# EAGLE design spiderBoardv17-2014-12-18 (EAGLE 6.4)
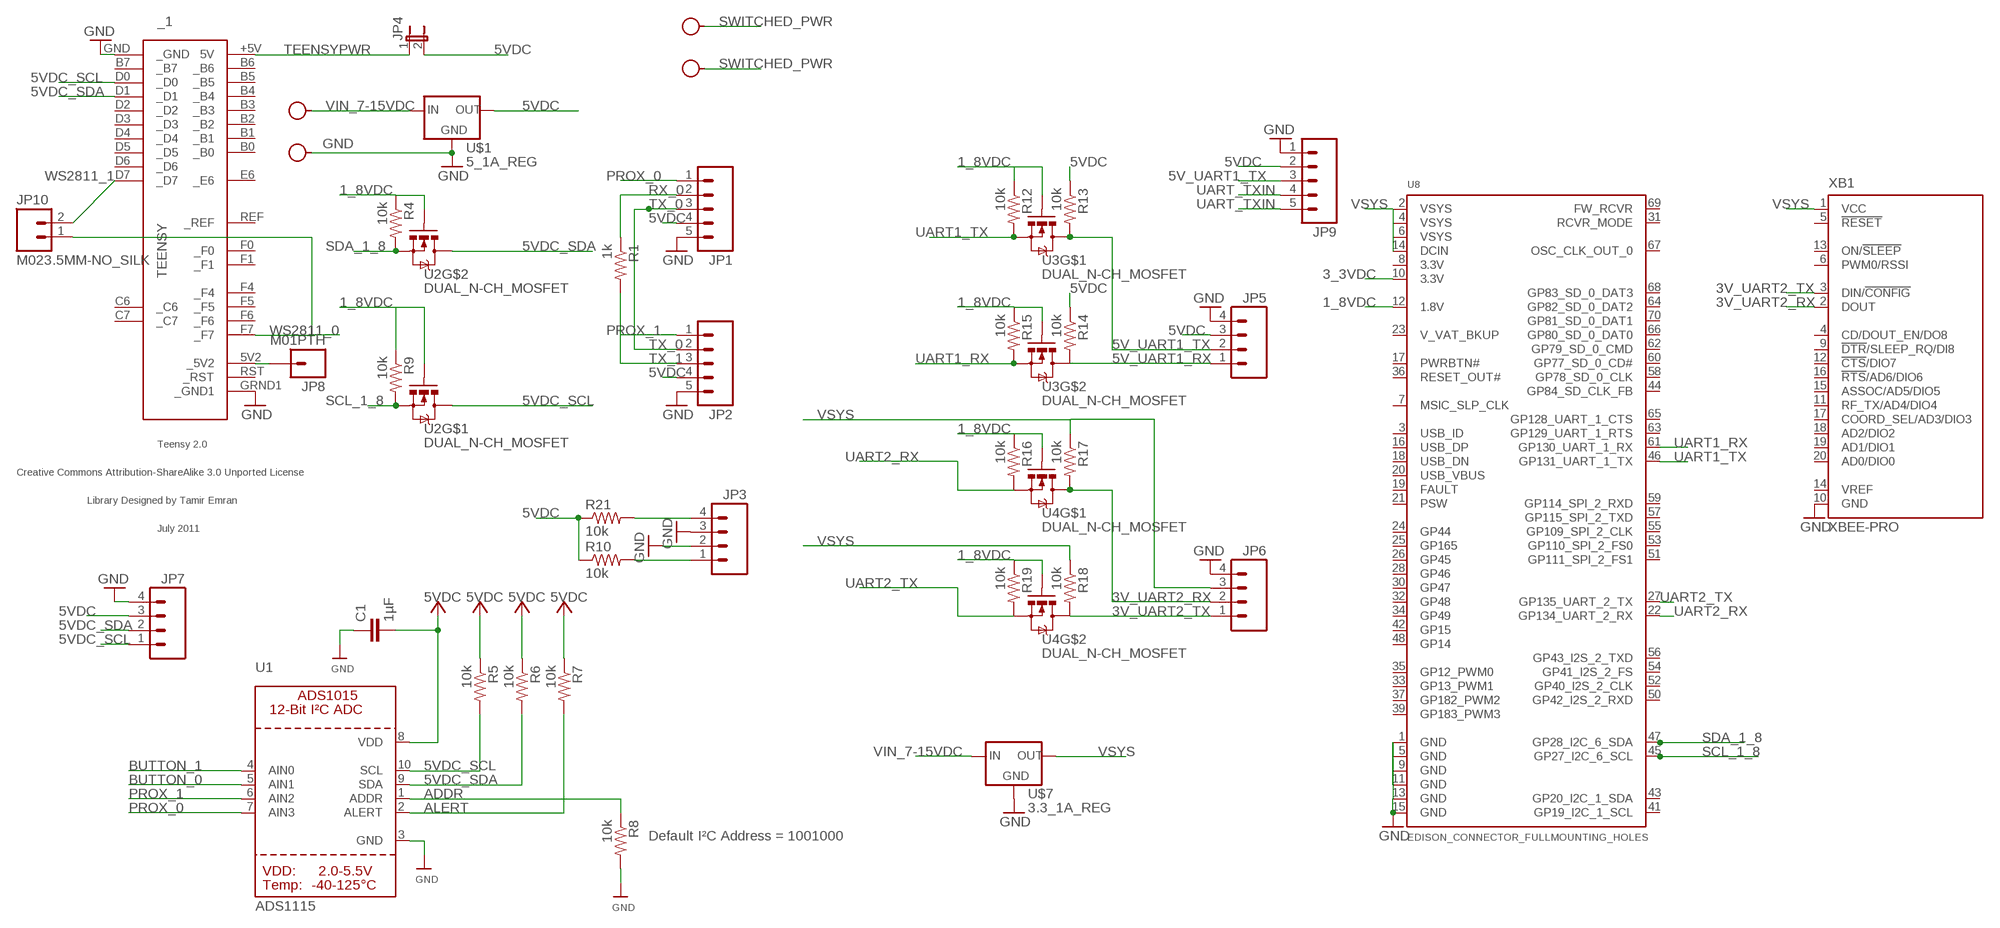
[diagram p0: schematic, sheet 1]

## Parts
_1  TEENSY  [TEENSY]
C1  1µF  CAP0603-CAP  [0603-CAP]
GND  SEW_HOLE-SMALL  [SIMPLE_HOLE_SM]
GND15  SEW_HOLE-SMALL  [SIMPLE_HOLE_SM]
JP1  M05PTH  [1X05]
JP2  M05PTH  [1X05]
JP3  M04PTH  [1X04]
JP4  JUMPER-2SMD-NC  [SJ_2S]
JP5  M04PTH  [1X04]
JP6  M04PTH  [1X04]
JP7  M04PTH  [1X04]
JP8  M01PTH  [1X01]
JP9  M05PTH  [1X05]
JP10  M023.5MM-NO_SILK  [SCREWTERMINAL-3.5MM-2-NS]
R1  1k  RESISTOR0603-RES  [0603-RES]
R4  10k  RESISTOR0603-RES  [0603-RES]
R5  10k  RESISTOR0603-RES  [0603-RES]
R6  10k  RESISTOR0603-RES  [0603-RES]
R7  10k  RESISTOR0603-RES  [0603-RES]
R8  10k  RESISTOR0603-RES  [0603-RES]
R9  10k  RESISTOR0603-RES  [0603-RES]
R10  10k  RESISTOR0603-RES  [0603-RES]
R12  10k  RESISTOR0603-RES  [0603-RES]
R13  10k  RESISTOR0603-RES  [0603-RES]
R14  10k  RESISTOR0603-RES  [0603-RES]
R15  10k  RESISTOR0603-RES  [0603-RES]
R16  10k  RESISTOR0603-RES  [0603-RES]
R17  10k  RESISTOR0603-RES  [0603-RES]
R18  10k  RESISTOR0603-RES  [0603-RES]
R19  10k  RESISTOR0603-RES  [0603-RES]
R21  10k  RESISTOR0603-RES  [0603-RES]
U1  ADS1115  ADC_ADS1015  [MSOP10]
U2  DUAL_N-CH_MOSFET  [SOT363_DUAL_N_MOSFET]
U3  DUAL_N-CH_MOSFET  [SOT363_DUAL_N_MOSFET]
U4  DUAL_N-CH_MOSFET  [SOT363_DUAL_N_MOSFET]
U8  EDISON_CONNECTOR_FULLMOUNTING_HOLES  [EDISON_DAUGHTER]
U$1  5_1A_REG  [1A_REG]
U$7  3.3_1A_REG  [1A_REG]
VIN_7-15VDC  SEW_HOLE-SMALL  [SIMPLE_HOLE_SM]
VIN_7-15VDC1  SEW_HOLE-SMALL  [SIMPLE_HOLE_SM]
XB1  XBEE-PRO  [XBEE-PRO]

## Nets
1_8VDC: R4.1 R9.1 R12.1 R15.1 R16.1 R19.1 U2.2(G) U2.5(G) U3.2(G) U3.5(G) U4.2(G) U4.5(G) U8.12(1.8V)
3_3VDC: U8.10(3.3V)
3V_UART2_RX: JP6.2 R17.2 U4.3(D) XB1.2(DOUT)
3V_UART2_TX: JP6.1 R18.2 U4.6(D) XB1.3(DIN/!CONFIG)
5V_UART1_RX [VSYS]: JP5.1 R14.2 U3.6(D)
5V_UART1_TX: JP5.2 JP9.3 R13.2 U3.3(D)
5VDC [5VDC]: C1.2 JP1.4 JP2.4 JP4.2 JP5.3 JP7.3 JP9.2 R5.1 R6.1 R7.1 R10.1 R13.1 R14.1 R21.1 U1.8(VDD) U$1.OUT ; supply symbol labelled VDD
5VDC_SCL: _1.D0(_D0) JP7.1 R5.2 U1.10(SCL) U2.3(D)
5VDC_SDA: _1.D1(_D1) JP7.2 R6.2 U1.9(SDA) U2.6(D)
ADDR: R8.1 U1.1(ADDR)
ALERT: R7.2 U1.2(ALERT)
BUTTON_0: JP3.4 R21.2 U1.5(AIN1)
BUTTON_1: JP3.1 R10.2 U1.4(AIN0)
GND: _1.GND(_GND) _1.GRND1(_GND1) C1.1 GND.P$1 JP1.5 JP2.5 JP3.2 JP3.3 JP5.4 JP6.4 JP7.4 JP9.1 R8.2 U1.3(GND) U8.1(GND) U8.5(GND) U8.9(GND) U8.11(GND) U8.13(GND) U8.15(GND) U$1.GND U$7.GND XB1.10(GND)
PROX_0: JP1.1 U1.7(AIN3)
PROX_1: JP2.1 U1.6(AIN2)
RX_0: JP1.2 R1.1
SCL_1_8: R9.2 U2.4(S) U8.45(GP27_I2C_6_SCL)
SDA_1_8: R4.2 U2.1(S) U8.47(GP28_I2C_6_SDA)
SWITCHED_PWR [VSYS]: GND15.P$1 VIN_7-15VDC1.P$1
TEENSYPWR: _1.5V2(_5V2) _1.+5V(5V) JP4.1 JP8.1
TX_0: JP1.3 JP2.2
TX_1: JP2.3 R1.2
UART1_RX: R15.2 U3.1(S) U8.61(GP130_UART_1_RX)
UART1_TX: R12.2 U3.4(S) U8.46(GP131_UART_1_TX)
UART2_RX: R16.2 U4.4(S) U8.22(GP134_UART_2_RX)
UART2_TX: R19.2 U4.1(S) U8.27(GP135_UART_2_TX)
UART_TXIN: JP9.4 JP9.5
VIN_7-15VDC [VSYS]: U$1.IN U$7.IN VIN_7-15VDC.P$1
VSYS: JP6.3 R17.1 R18.1 U8.2(VSYS) U8.4(VSYS) U8.6(VSYS) U8.14(DCIN) U$7.OUT XB1.1(VCC)
WS2811_0: _1.F7(_F7) JP10.1
WS2811_1: _1.D7(_D7) JP10.2
Unconnected: _1.B0(_B0) _1.B1(_B1) _1.B2(_B2) _1.B3(_B3) _1.B4(_B4) _1.B5(_B5) _1.B6(_B6) _1.B7(_B7) _1.C6(_C6) _1.C7(_C7) _1.D2(_D2) _1.D3(_D3) _1.D4(_D4) _1.D5(_D5) _1.D6(_D6) _1.E6(_E6) _1.F0(_F0) _1.F1(_F1) _1.F4(_F4) _1.F5(_F5) _1.F6(_F6) _1.REF(_REF) _1.RST(_RST) U8.3(USB_ID) U8.7(MSIC_SLP_CLK) U8.8(3.3V) U8.16(USB_DP) U8.17(PWRBTN#) U8.18(USB_DN) U8.19(FAULT) U8.20(USB_VBUS) U8.21(PSW) U8.23(V_VAT_BKUP) U8.24(GP44) U8.25(GP165) U8.26(GP45) U8.28(GP46) U8.30(GP47) U8.31(RCVR_MODE) U8.32(GP48) U8.33(GP13_PWM1) U8.34(GP49) U8.35(GP12_PWM0) U8.36(RESET_OUT#) U8.37(GP182_PWM2) U8.39(GP183_PWM3) U8.41(GP19_I2C_1_SCL) U8.42(GP15) U8.43(GP20_I2C_1_SDA) U8.44(GP84_SD_CLK_FB) U8.48(GP14) U8.50(GP42_I2S_2_RXD) U8.51(GP111_SPI_2_FS1) U8.52(GP40_I2S_2_CLK) U8.53(GP110_SPI_2_FS0) U8.54(GP41_I2S_2_FS) U8.55(GP109_SPI_2_CLK) U8.56(GP43_I2S_2_TXD) U8.57(GP115_SPI_2_TXD) U8.58(GP78_SD_0_CLK) U8.59(GP114_SPI_2_RXD) U8.60(GP77_SD_0_CD#) U8.62(GP79_SD_0_CMD) U8.63(GP129_UART_1_RTS) U8.64(GP82_SD_0_DAT2) U8.65(GP128_UART_1_CTS) U8.66(GP80_SD_0_DAT0) U8.67(OSC_CLK_OUT_0) U8.68(GP83_SD_0_DAT3) U8.69(FW_RCVR) U8.70(GP81_SD_0_DAT1) XB1.4(CD/DOUT_EN/DO8) XB1.5(!RESET) XB1.6(PWM0/RSSI) XB1.9(!DTR!/SLEEP_RQ/DI8) XB1.11(RF_TX/AD4/DIO4) XB1.12(!CTS!/DIO7) XB1.13(ON/!SLEEP) XB1.14(VREF) XB1.15(ASSOC/AD5/DIO5) XB1.16(!RTS!/AD6/DIO6) XB1.17(COORD_SEL/AD3/DIO3) XB1.18(AD2/DIO2) XB1.19(AD1/DIO1) XB1.20(AD0/DIO0)

## Notes on the sheet
- Default I²C Address = 1001000

## Library data of the parts
_1 = teensy:TEENSY: Teensy 2.0 Original Design by Clint Fisher Modified Design by Tamir Emran Licensed Under Creative Commons Attribution-ShareAlike 3.0 Unported (CC BY-SA 3.0)
C1 = SparkFun-Capacitors:CAP: Capacitor Standard 0603 ceramic capacitor, and 0.1" leaded capacitor.
GND GND15 VIN_7-15VDC VIN_7-15VDC1 = LilyPad-Wearables:SEW_HOLE-SMALL: .070" hole with 20mil annular ring
JP1 JP2 JP9 = SparkFun-Connectors:M05: Header 5 Standard 5-pin 0.1" header. Use with straight break away headers (SKU : PRT-00116), right angle break away headers (PRT-00553), swiss pins (PRT-00743), machine pins (PRT-00117), and female headers (PRT-00115). Molex polarized connector foot print use with SKU : PRT-08230 with associated crimp pins and housings.
JP3 JP5-JP7 = SparkFun-Connectors:M04: Header 4 Standard 4-pin 0.1" header. Use with straight break away headers (SKU : PRT-00116), right angle break away headers (PRT-00553), swiss pins (PRT-00743), machine pins (PRT-00117), and female headers (PRT-00115). Molex polarized connector foot print use with SKU : PRT-08231 with associated crimp pins and housings. 1MM SMD Version SKU: PRT-10208
JP4 = SparkFun-Passives:JUMPER-2: Jumper Basic 0.1" spaced jumper. Use with breakaway headers.
JP8 = SparkFun-Connectors:M01: Header 1 Standard 1-pin 0.1" header. Use with straight break away headers (SKU : PRT-00116), right angle break away headers (PRT-00553), swiss pins (PRT-00743), machine pins (PRT-00117), and female headers (PRT-00115).
JP10 = SparkFun-Connectors:M02: Standard 2-pin 0.1" header. Use with - straight break away headers ( PRT-00116) - right angle break away headers (PRT-00553) - swiss pins (PRT-00743) - machine pins (PRT-00117) - female headers (PRT-00115) Molex polarized connector foot print use with: PRT-08233 with associated crimp pins and housings. 2.54_SCREWTERM for use with PRT-10571. 3.5mm Screw Terminal footprints for PRT-08084 5mm Screw Terminal footprints for use with PRT-08433
R1 R4-R10 R12-R19 R21 = SparkFun-Passives:RESISTOR: Resistor Basic schematic elements and footprints for 0603, 1206, and PTH resistors.
U1 = microbuilder:ADC_ADS1015: ADS1015 - 12-bit 4-Channel I2C ADC with Internal PGA VDD: 2.0-5.5V Sampling Rate: 3.3ksps Gain Settings: 2/3, 1, 2, 4, 8, 16 I2C Address: ADDR low = 1001000x, ADDR high = 1001001x Internal Comparator The ADS1015 includes an internal comparator that can be set to output a high-level on ALERT when the conversion results exceeeds a pre-defined upper level, and will deassert itself when the level falls below a pre-defined lower threshold level. It can also be set to windowed mode where the ALERT pin will be asserted if the data exceeds the upper threshold or falls below the lower threshold.
U2-U4 = bss138_part:DUAL_N-CH_MOSFET
U8 = Edison:EDISON_CONNECTOR_FULL
U$1 = pololu:5_1A_REG
U$7 = pololu:3.3_1A_REG
XB1 = mpinnermaxstream:XBEE: XBee (TM) /XBee-PRO(TM) OEM RF Modules Source: MaxStream, Inc. xbee_productmanual.pdf; MPN: XBP24-AWI-001; OC_FARNELL: 1337916; OC_NEWARK: 42M2667

## Net classes
0 default: width 0.152 mm
1 5VDC: width 0.406 mm
2 VSYS: width 0.762 mm

## Board
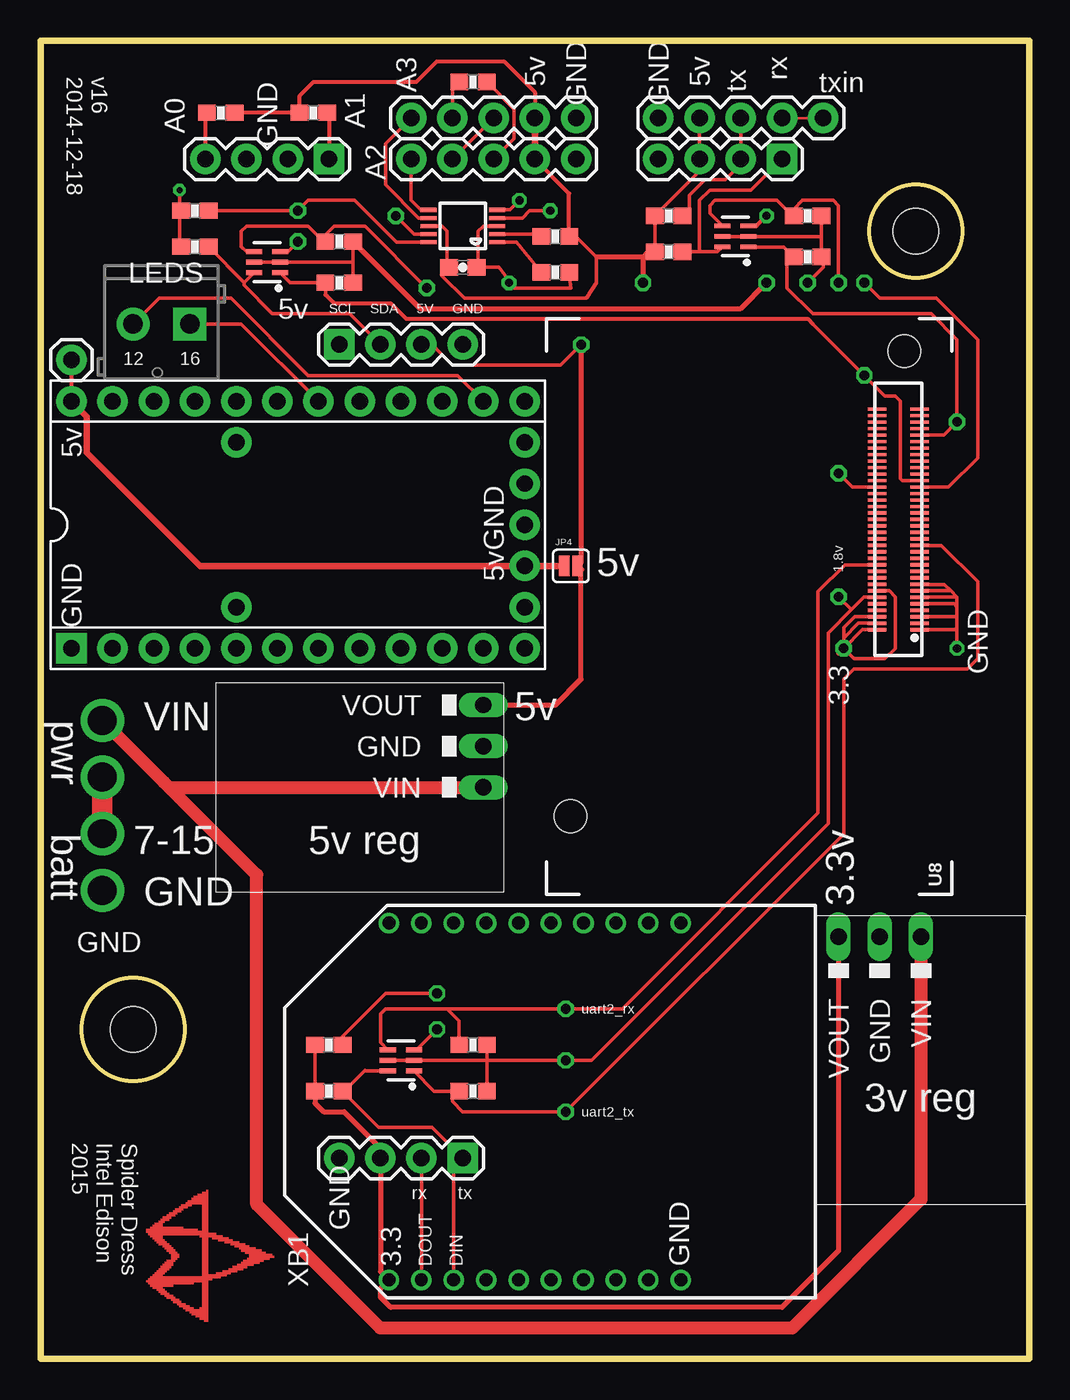
[diagram p1: board, top side]
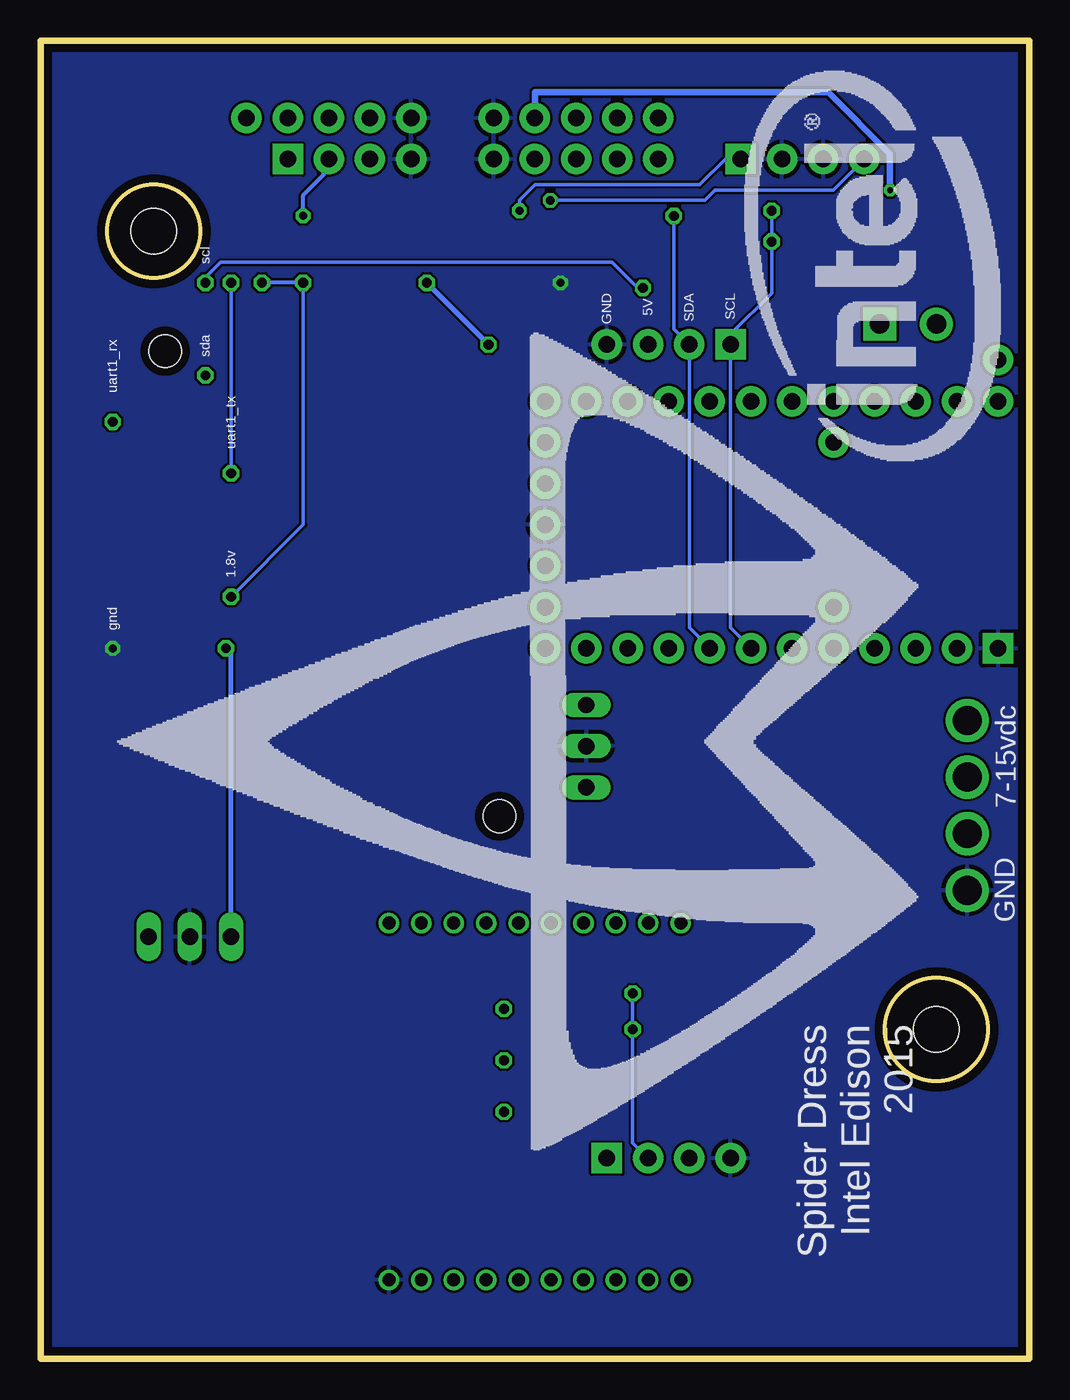
[diagram p2: board, bottom side, seen from below]

Size 60.96 x 81.29 mm. Coordinates in mm from the lower left corner, seen from the top.
Outline: 0,0 60.95,0 60.95,81.29 0,81.27
Outline: 0,0 60.96,0 60.96,81.28 0,81.28 0,81.27
Outline: 0,81.27 0,0
Outline: circle at 5.71,20.32 radius 3.17
Outline: circle at 53.98,69.53 radius 2.86
Copper layers (1*16): Top 0.0178mm / dielectric 59mil / Bottom 0.0178mm
Design rules "SSC-EAGLE-2Lyr_v1.0.0.3": minimum track width 6mil, minimum drill 14mil, track to track 6mil, track to pad 6mil, pad to pad 6mil, via to via 6mil, smd to smd 6mil, copper to edge 20mil, drill to drill 16mil, minimum pad ring 8mil, minimum via ring 8mil, stop-mask expansion 3mil, vias tented up to drill 0mil, thermal gap 10mil
Holes 2.8 mm at 5.71,20.32 53.98,69.53

### Footprints (pad centres in the part's own frame; a part is rotated, then mirrored left to right if it is on the bottom)
TEENSY = drill 1.016 pad 1.88: 5V2 13.97,-2.54; +5V -13.97,7.62; B0 -11.43,-7.62; B1 -8.89,-7.62; B2 -6.35,-7.62; B3 -3.81,-7.62; B4 8.89,7.62; B5 6.35,7.62; B6 3.81,7.62; B7 -1.27,-7.62; C6 11.43,-7.62; C7 13.97,-7.62; D0 1.27,-7.62; D1 3.81,-7.62; D2 6.35,-7.62; D3 8.89,-7.62; D4 13.97,5.08; D5 13.97,-5.08; D6 13.97,7.62; D7 11.43,7.62; E6 -3.81,-5.08; F0 -11.43,7.62; F1 -8.89,7.62; F4 -6.35,7.62; F5 -3.81,7.62; F6 -1.27,7.62; F7 1.27,7.62; GRND1 13.97,0; REF -3.81,5.08; RST 13.97,2.54 | drill 1.016 pad 1.88 square: GND -13.97,-7.62
0603-CAP = smd 1.1 x 1: 1 -0.85,0; 2 0.85,0
SIMPLE_HOLE_SM = drill 1.778 pad 2.286: P$1 0,0
1X05 = drill 1.016 pad 1.88: 1 0,0; 2 2.54,0; 3 5.08,0; 4 7.62,0; 5 10.16,0
1X04 = drill 1.016 pad 1.88 square: 1 0,0 | drill 1.016 pad 1.88: 2 2.54,0; 3 5.08,0; 4 7.62,0
SJ_2S = smd 0.635 x 1.27: 1 -0.412,0; 2 0.412,0
1X01 = drill 1.016 pad 1.88: 1 0,0
SCREWTERMINAL-3.5MM-2-NS = drill 1.2 pad 2.032 square: 1 0,0 | drill 1.2 pad 2.032: 2 3.5,0
0603-RES = smd 1.1 x 1: 1 -0.85,0; 2 0.85,0
MSOP10 = smd 0.25 x 1: 1 -1,-2.113; 2 -0.5,-2.113; 3 0,-2.113; 4 0.5,-2.113; 5 1,-2.113; 6 1,2.113; 7 0.5,2.113; 8 0,2.113; 9 -0.5,2.113; 10 -1,2.113
SOT363_DUAL_N_MOSFET = smd 0.3 x 0.99: 1 -0.65,-0.8; 2 0,-0.8; 3 0.65,-0.8; 4 0.65,0.81; 5 0,0.81; 6 -0.65,0.81
EDISON_DAUGHTER = smd 1.14 x 0.2: 1 1.98,19.17; 2 4.62,19.17; 3 1.98,18.77; 4 4.62,18.77; 5 1.98,18.37; 6 4.62,18.37; 7 1.98,17.97; 8 4.62,17.97; 9 1.98,17.57; 10 4.62,17.57; 11 1.98,17.17; 12 4.62,17.17; 13 1.98,16.77; 14 4.62,16.77; 15 1.98,16.37; 16 4.62,16.37; 17 1.98,15.97; 18 4.62,15.97; 19 1.98,15.57; 20 4.62,15.57; 21 1.98,15.17; 22 4.62,15.17; 23 1.98,14.77; 24 4.62,14.77; 25 1.98,14.37; 26 4.62,14.37; 27 1.98,13.97; 28 4.62,13.97; 29 1.98,13.57; 30 4.62,13.57; 31 1.98,13.17; 32 4.62,13.17; 33 1.98,12.77; 34 4.62,12.77; 35 1.98,12.37; 36 4.62,12.37; 37 1.98,11.97; 38 4.62,11.97; 39 1.98,11.57; 40 4.62,11.57; 41 1.98,11.17; 42 4.62,11.17; 43 1.98,10.77; 44 4.62,10.77; 45 1.98,10.37; 46 4.62,10.37; 47 1.98,9.97; 48 4.62,9.97; 49 1.98,9.57; 50 4.62,9.57; 51 1.98,9.17; 52 4.62,9.17; 53 1.98,8.77; 54 4.62,8.77; 55 1.98,8.37; 56 4.62,8.37; 57 1.98,7.97; 58 4.62,7.97; 59 1.98,7.57; 60 4.62,7.57; 61 1.98,7.17; 62 4.62,7.17; 63 1.98,6.77; 64 4.62,6.77; 65 1.98,6.37; 66 4.62,6.37; 67 1.98,5.97; 68 4.62,5.97; 69 1.98,5.57; 70 4.62,5.57 | hole 2: 23.53,30.67; 2.93,1.98
1A_REG = drill 1.016 long: GND 8.89,1.27; IN 6.35,1.27; OUT 11.43,1.27
XBEE-PRO = drill 0.8 pad 1.27: 1 -11,9; 2 -11,7; 3 -11,5; 4 -11,3; 5 -11,1; 6 -11,-1; 7 -11,-3; 8 -11,-5; 9 -11,-7; 10 -11,-9; 11 11,-9; 12 11,-7; 13 11,-5; 14 11,-3; 15 11,-1; 16 11,1; 17 11,3; 18 11,5; 19 11,7; 20 11,9

### Placement (x,y rotation side)
_1  15.88,51.44 0 top
C1  26.04,67.31 180 top
GND  3.81,28.89 0 top
GND15  3.81,35.88 0 top
JP1  22.86,76.52 0 top
JP2  22.86,73.98 0 top
JP3  17.78,73.98 180 top
JP4  32.7,48.9 0 top
JP5  45.72,73.98 180 top
JP6  26.04,12.38 180 top
JP7  18.41,62.55 0 top
JP8  1.91,61.59 0 top
JP9  38.1,76.52 0 top
JP10  9.21,63.82 180 top
R1  26.67,78.74 0 top
R4  18.41,66.36 180 top
R5  9.53,70.8 0 top
R6  9.53,68.58 0 top
R7  31.75,69.22 180 top
R8  31.75,66.99 0 top
R9  18.41,68.9 180 top
R10  16.83,76.83 0 top
R12  47.31,70.48 180 top
R13  38.73,70.48 0 top
R14  38.73,68.26 0 top
R15  47.31,67.94 180 top
R16  26.67,19.37 180 top
R17  17.78,19.37 0 top
R18  17.78,16.51 0 top
R19  26.67,16.51 180 top
R21  11.11,76.83 180 top
U1  26.04,69.85 90 top
U2  13.97,67.63 90 top
U3  42.86,69.22 90 top
U4  22.23,18.41 90 top
U8  56.2,64.14 180 top
U$1  28.57,28.89 90 top
U$7  60.64,27.3 180 top
U$9  [NOUK-800]  20.32,38.1 180 bottom
U$11  [NOUKLOGO300MIL_COPPER]  8.57,6.38 270 top
U$12  [INTEL_1IN]  7.11,66.17 90 bottom
VIN_7-15VDC  3.81,39.37 0 top
VIN_7-15VDC1  3.81,32.38 0 top
XB1  30.48,15.88 90 top

### Tracks (layer width: path | path; a pad name or v marks a point on that pad's centre or on a via)
1_8VDC  (via drill 0.6)
  Top 0.203: R12.1 48.16,69.22 | 48.16,69.22 R15.1 48.26,67.94 48.26,67.31 v47.31,66.36 | 48.16,69.22 U3.2 U3.5 | U2.5 U2.2 19.27,67.63 | R9.1 19.27,67.63 | 19.27,67.63 R4.1 | U4.5 U4.2 27.62,18.41 | R16.1 27.52,18.52 27.62,18.41 | R19.1 27.52,18.31 27.62,18.41 | U8.12 50.77,46.97 50.01,46.2 | 50.01,46.2 48.58,44.77 48.58,33.02 33.97,18.41 v32.38,18.41 27.62,18.41 | v49.21,46.99 50.01,46.2
  Top 0.305: R9.1 23.39,64.77 43.18,64.77 v44.77,66.36
  Bottom 0.203: v49.21,46.99 44.77,51.44 v44.77,66.36
  Bottom 0.254: v44.77,66.36 v47.31,66.36
3V_UART2_RX  (via drill 0.6)
  Top 0.203: XB1.2 23.5,4.89 JP6.2 | U4.3 23.19,19.07 v24.45,20.32 | R17.2 18.63,19.9 21.27,22.54 v24.45,22.54
  Bottom 0.203: JP6.2 24.45,13.34 v24.45,20.32 v24.45,22.54
3V_UART2_TX
  Top 0.203: XB1.3 25.48,11.83 JP6.1 24.13,14.29 20.85,14.29 R18.2 18.73,16.51 20,17.78 20.02,17.77 U4.6
5V_UART1_RX
  Top 0.203: R14.2 40.64,68.26 | 40.64,68.26 41.75,68.26 U3.6 | JP5.1 43.81,72.07 41.27,72.07 40.64,71.44 40.64,68.26
5V_UART1_TX  (via drill 0.5)
  Top 0.203: R13.2 40.01,70.48 40.01,71.75 40.96,72.71 42.23,72.71 43.18,73.66 JP5.2 JP9.3
  Top 0.254: U3.3 44.15,69.86 v44.77,70.48
  Bottom 0.254: v44.77,70.48 44.77,71.75 43.5,73.03 43.5,73.66 JP5.2
5VDC  (via drill 0.36, 0.6)
  Top 0.203: R14.1 R13.1 40.64,73.24 JP9.2 JP5.3 | U1.8 24.77,69.85 25.08,69.53 25.08,67.41 C1.2 24.77,66.99 24.77,66.78 26.14,65.41 33.66,65.41 34.29,66.36 34.29,67.94 33.02,69.22 R7.1 | R5.1 8.57,70.91 | 8.57,70.91 v8.57,72.07 | R6.1 8.57,68.68 8.57,70.91 | JP7.3 24.13,62.55 25.4,61.28 32.07,61.28 v33.34,62.55
  Top 0.254: R7.1 32.6,71.86 JP2.4 | JP1.4 30.48,78.11 28.57,80.01 24.45,80.01 23.18,78.74 16.83,78.74 15.98,77.89 R10.1 R21.1
  Top 0.305: 37.15,67.94 v37.15,66.36 | 37.15,67.94 37.47,68.26 R14.1 | v33.34,62.55 33.34,49.12 JP4.2 | 37.15,67.94 34.29,67.94 | U$1.OUT 31.75,40.32 33.34,41.91 33.34,48.67
  Top 0.406: JP2.4 JP1.4 | 33.34,48.67 JP4.2
  Bottom 0.305: v37.15,66.36 v33.34,62.55
  Bottom 0.406: v8.57,72.07 8.57,74.3 12.38,78.11 30.48,78.11 JP1.4
5VDC_SCL  (via drill 0.6)
  Top 0.203: U2.3 15.26,68.28 v15.88,68.9 | R5.2 v15.88,70.8 16.51,71.44 19.37,71.44 21.95,68.85 U1.10
  Bottom 0.203: v15.88,70.8 v15.88,68.9 15.88,65.72 18.41,63.18 JP7.1 18.41,45.09 _1.D0
5VDC_SDA  (via drill 0.6)
  Top 0.203: R6.2 12.54,66.36 | 12.54,66.36 U2.6 12.7,66.52 | JP7.2 19.05,64.45 14.29,64.45 12.54,66.2 12.54,66.36 | U1.9 23.04,69.35 v21.91,70.48
  Bottom 0.203: v21.91,70.48 21.91,63.5 JP7.2 20.95,45.09 _1.D1
ADDR
  Top 0.203: U1.1 29.36,68.85 R8.1
ALERT
  Top 0.203: R7.2 30.58,69.53 30.48,69.53 30.3,69.35 U1.2
BUTTON_0  (via drill 0.5)
  Top 0.203: U1.5 28.94,70.85 v29.53,71.44
  Top 0.254: R21.2 10.16,76.73 JP3.4
  Bottom 0.203: v29.53,71.44 20,71.44 19.37,72.07 12.06,72.07 JP3.4
BUTTON_1  (via drill 0.5)
  Top 0.203: v31.43,70.8 30.16,70.8 29.71,70.35 U1.4
  Top 0.254: R10.2 17.78,76.73 JP3.1
  Bottom 0.203: JP3.1 18.73,73.98 20.32,72.39 30.48,72.39 31.43,71.44 v31.43,70.8
GND  (via drill 0.5)
  Top 0.152: v28.89,66.36 28.94,66.4
  Top 0.203: U8.15 55.74,47.77 56.14,47.37 | 56.52,46.99 56.52,46.35 | 56.52,46.35 56.52,45.72 | 56.52,45.72 56.52,45.09 | 56.52,45.09 v56.52,43.81 | U8.1 56.4,44.97 56.52,45.09 | U8.5 56.47,45.77 56.52,45.72 | U8.9 56.3,46.56 56.52,46.35 | U8.11 56.49,46.97 56.52,46.99 | U8.13 56.14,47.37 | 56.14,47.37 56.52,46.99 | R8.2 32.6,66.89 32.7,66.04 29.21,66.04 28.94,66.4 28.26,67.31 C1.1 26.99,67.41 26.99,69.53 27.3,69.85 U1.3
  pour Bottom: -0.32,-0.32 60.96,0 60.96,81.6 -0.32,81.6
PROX_0
  Top 0.203: U1.7 23.31,70.35 21.27,72.39 21.27,74.93 JP1.1
PROX_1
  Top 0.203: U1.6 23.45,70.85 22.86,71.44 JP2.1
RX_0
  Top 0.203: JP1.2 25.4,78.32 R1.1
SCL_1_8  (via drill 0.6)
  Top 0.203: U2.4 13.14,68.26 12.7,68.26 12.38,68.58 12.38,69.53 12.7,69.85 16.51,69.85 17.46,68.9 R9.2 17.57,69.32 18.1,69.85 20,69.85 v23.81,66.04 | U8.45 55.99,53.77 57.78,55.56 57.78,62.87 55.24,65.41 51.75,65.41 v50.8,66.36
  Bottom 0.203: v50.8,66.36 50.8,66.67 49.85,67.63 25.72,67.63 24.13,66.04 v23.81,66.04
SDA_1_8  (via drill 0.6)
  Top 0.203: U2.1 15.39,66.36 R4.2 17.57,65.62 | U8.47 53.15,54.16 53.02,54.29 53.02,59.05 52.7,59.37 52.07,59.37 v50.8,60.64 47.62,63.82
  Top 0.254: 17.57,65.62 18.1,65.09 21.59,65.09 22.54,64.14 47.31,64.14 47.62,63.82
SWITCHED_PWR
  Top 1.27: GND15.P$1 VIN_7-15VDC1.P$1
TEENSYPWR
  Top 0.254: JP8.1 _1.+5V
  Top 0.406: JP4.1 _1.5V2 9.84,48.9 2.86,55.88 2.86,58.1 _1.+5V
TX_0
  Top 0.203: JP2.2 JP1.3
TX_1
  Top 0.203: JP2.3 29.21,75.25 29.21,77.05 R1.2
UART1_RX  (via drill 0.6)
  Top 0.203: U3.1 45.84,68.56 R15.2 46.04,67.73 46.04,66.04 47.62,64.45 54.93,64.45 56.52,62.87 v56.52,57.78 55.7,56.97 U8.61
UART1_TX  (via drill 0.6)
  Top 0.203: U3.4 41.27,70.64 41.27,71.12 41.59,71.44 45.4,71.44 46.35,70.48 R12.2 46.46,70.91 46.99,71.44 48.9,71.44 49.21,71.12 v49.21,66.36 | U8.46 50.06,53.77 v49.21,54.61
  Bottom 0.203: v49.21,66.36 v49.21,54.61
UART2_RX  (via drill 0.6)
  Top 0.203: R16.2 25.82,20.85 25.08,21.59 | 25.08,21.59 21.27,21.59 20.95,21.27 20.95,19.52 U4.4 | 25.08,21.59 v32.38,21.59 35.88,21.59 47.94,33.66 47.94,47.31 49.6,48.97 U8.22
UART2_TX  (via drill 0.6)
  Top 0.203: U4.1 24.28,16.51 R19.2 25.4,16.09 25.4,15.88 26.04,15.24 v32.38,15.24 49.53,32.38 49.53,41.91 50.16,42.55 57.15,42.55 57.78,43.18 57.78,47.94 55.56,50.16 U8.27
UART_TXIN
  Top 0.152: JP9.5 JP9.4
VIN_7-15VDC
  Top 0.813: VIN_7-15VDC.P$1 7.62,35.56 7.94,35.24 | 7.94,35.24 U$1.IN | U$7.IN 54.29,9.84 46.35,1.91 20.95,1.91 13.34,9.53 13.34,29.84 7.94,35.24
VSYS  (via drill 0.6)
  Top 0.203: R18.1 R17.1 | 51.08,45.37 U8.4 50.45,45.37 49.53,44.45 | U8.6 50.21,45.77 49.53,45.09 49.53,44.45 | 49.53,44.45 v49.53,43.81 | U8.2 50.68,44.97 v49.53,43.81 | U8.14 52.33,47.37 52.7,46.99 52.7,43.81 52.07,43.18 50.16,43.18 v49.53,43.81
  Top 0.305: 20.95,12.48 JP6.3 | JP6.3 20.95,5.4 XB1.1 20.95,4.35 20.95,3.81 21.59,3.17 45.72,3.17 49.21,6.67 U$7.OUT | R18.1 16.93,15.77 17.46,15.24 18.73,15.24 20.64,13.34 20.64,12.7 JP6.3 | 49.21,43.5 v49.53,43.81
  Bottom 0.305: U$7.OUT 49.21,43.5 v49.53,43.81
WS2811_0
  Top 0.203: _1.F7 12.38,63.82 JP10.1
WS2811_1
  Top 0.203: _1.D7 25.72,60.64 16.51,60.64 11.75,65.41 7.3,65.41 JP10.2

### Text on the board
tPlace: GND | GND | 5v | 5v | rx | v16 / 2014-12-18 | GND | txin | A3 | tx | A0 | A1 | A2 | LEDS | 5v | SCL | SDA | 5V | GND | 12 | 16 | 5v | GND | 1.8v | 5v | 5v | GND | GND | 3.3 | pwr | VIN | 5v | batt | 7-15 | 5v reg | GND | 3.3v | GND | uart2_rx | uart2_tx | 3v reg | Spider Dress / Intel Edison / 2015 | rx | tx | GND | 3.3 | DOUT | DIN | GND
bPlace: scl | SCL | SDA | GND | 5V | sda | uart1_rx | uart1_tx | 1.8v | gnd | 7-15vdc | GND | Spider Dress / Intel Edison / 2015